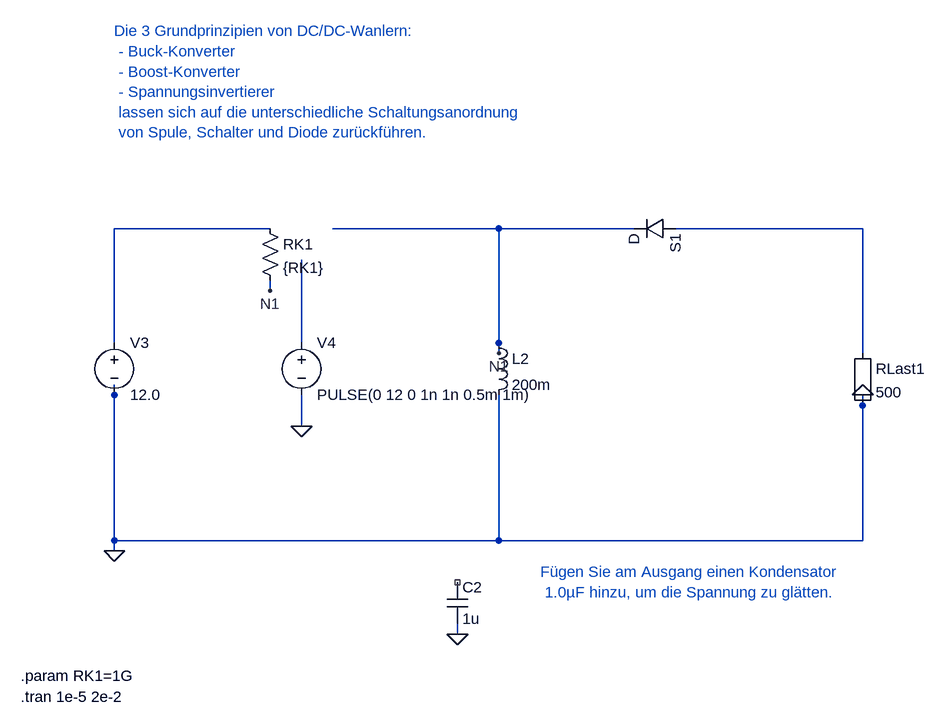
[diagram p0: schematic 2_1_3_Spannungsinverter.asc]
2_1_3_Spannungsinverter.asc, the LTspice schematic file:
Version 4
SHEET 1 880 680
WIRE 208 656 208 640
WIRE 1008 400 976 400
WIRE 496 656 496 672
WIRE 736 1008 736 1024
WIRE 208 896 208 880
WIRE 208 880 208 640
WIRE 496 576 496 448
WIRE 496 704 496 672
WIRE 1360 672 1360 880
WIRE 1360 880 800 880
WIRE 1360 592 1360 400
WIRE 1360 400 1072 400
WIRE 800 576 800 400
WIRE 800 400 544 400
WIRE 976 400 800 400
WIRE 448 400 208 400
WIRE 208 400 208 576
WIRE 800 880 208 880
WIRE 800 656 800 880
WIRE 1360 672 1360 656
WIRE 800 576 800 592
WIRE 448 480 448 496
FLAG 208 896 0
FLAG 496 704 0
FLAG 736 1024 0
FLAG 1360 656 0
FLAG 496 704 0
FLAG 736 1024 0
FLAG 800 592 N1
FLAG 448 496 N1
SYMBOL voltage 208 560 R0
SYMATTR InstName V3
SYMATTR Value 12.0
SYMBOL res 432 384 R0
SYMATTR InstName RK1
SYMATTR Value {RK1}
SYMBOL ind 784 560 R0
SYMATTR InstName L2
SYMATTR Value 200m
SYMBOL diode 1072 384 R90
SYMATTR InstName S1
SYMATTR Value D
SYMBOL Misc\EuropeanResistor 1344 576 R0
SYMATTR InstName RLast1
SYMATTR Value 500
SYMBOL voltage 496 560 R0
SYMATTR InstName V4
SYMATTR Value PULSE(0 12 0 1n 1n 0.5m 1m)
SYMBOL cap 720 944 R0
SYMATTR InstName C2
SYMATTR Value 1u
TEXT 64 1088 Left 2 !.param RK1=1G
TEXT 64 1120 Left 2 !.tran 1e-5 2e-2
TEXT 208 96 Left 2 ;Die 3 Grundprinzipien von DC/DC-Wanlern: \n - Buck-Konverter \n - Boost-Konverter \n - Spannungsinvertierer \n lassen sich auf die unterschiedliche Schaltungsanordnung \n von Spule, Schalter und Diode zurückführen.
TEXT 864 928 Left 2 ;Fügen Sie am Ausgang einen Kondensator \n 1.0µF hinzu, um die Spannung zu glätten.

The netlist it stands for:
* 2_1_3_Spannungsinverter.asc
V3 N003 0 12.0
RK1 N003 N1 {RK1}
L2 N1 0 200m
D§S1 N002 N1 D
RLast1 N002 0 500
V4 N001 0 PULSE(0 12 0 1n 1n 0.5m 1m)
C2 NC_01 0 1u
.model D D
.lib standard.dio
.param RK1=1G
.tran 1e-5 2e-2
* Die 3 Grundprinzipien von DC/DC-Wanlern:
*  - Buck-Konverter
*  - Boost-Konverter
*  - Spannungsinvertierer
*  lassen sich auf die unterschiedliche Schaltungsanordnung
*  von Spule, Schalter und Diode zurückführen.
* Fügen Sie am Ausgang einen Kondensator
*  1.0µF hinzu, um die Spannung zu glätten.
.backanno
.end